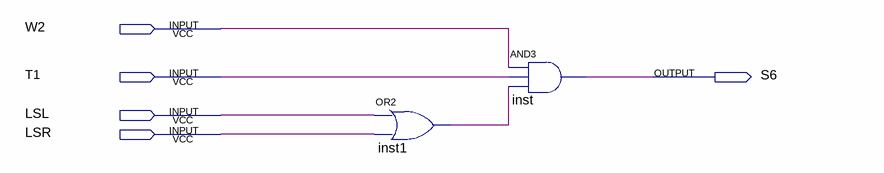
[diagram p0: schematic sheet]
// Quartus schematic S6.bdf as structural Verilog: 2 symbols, 5 pins
module S6 (
  input  W2,
  input  T1,
  input  LSL,
  input  LSR,
  output S6
);

  wire inst1_out;

  or inst1 (inst1_out, LSL, LSR);
  and inst (S6, W2, T1, inst1_out);
endmodule
